# Altium project JOYSTICK.PrjPcb
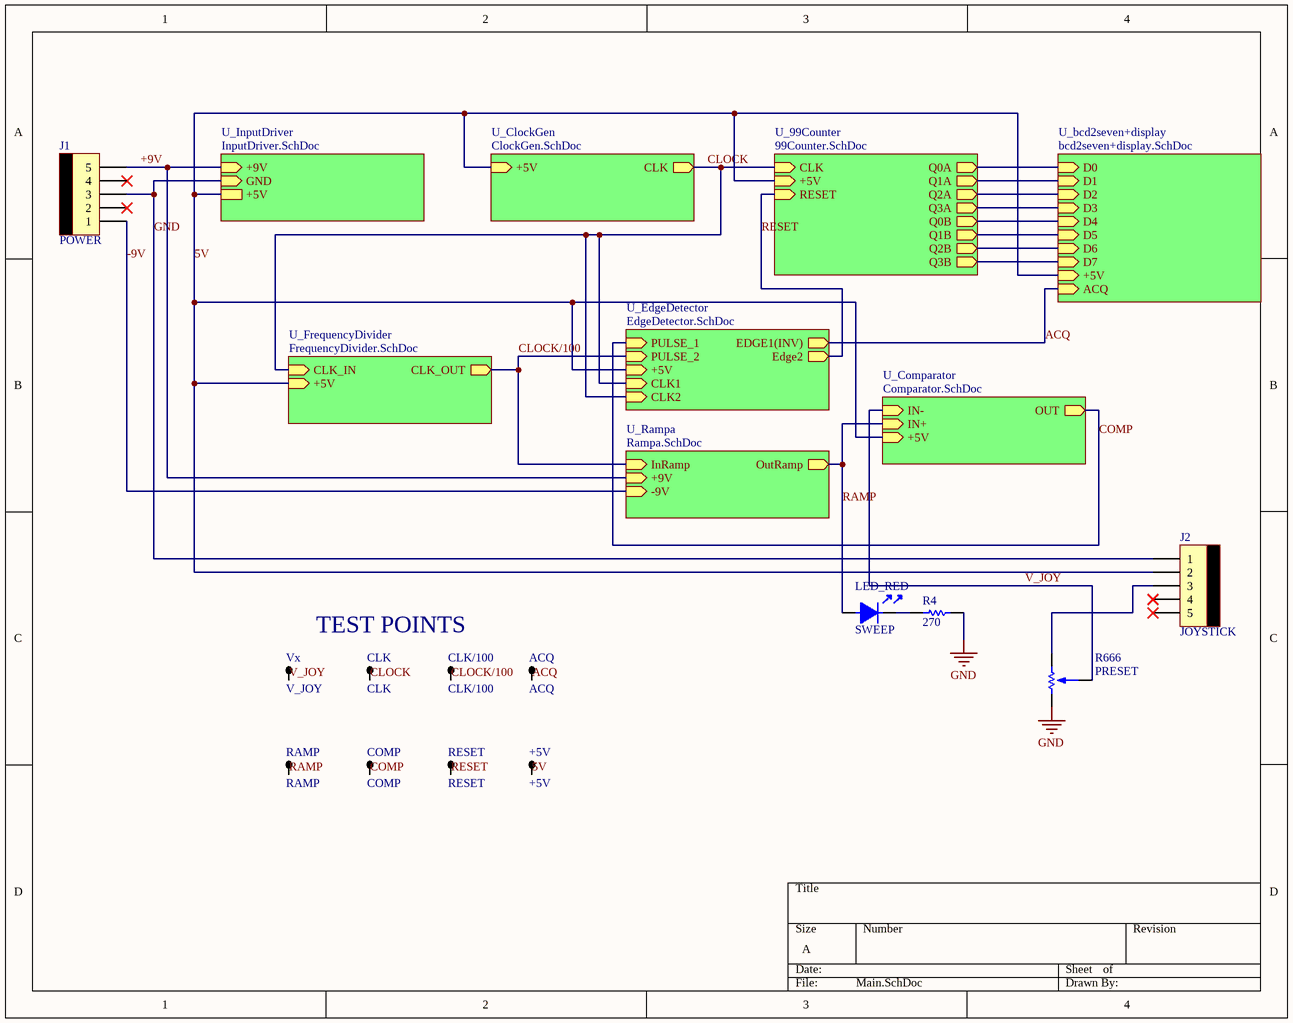
[diagram p0: Main.SchDoc]
9 sheets, 84 parts. Net scope: hierarchical (ports join the sheet entries above them; power ports are global).
Board file: Joystick.PcbDoc
Sheets:
  Main.SchDoc
    U_InputDriver = InputDriver.SchDoc
    U_ClockGen = ClockGen.SchDoc
    U_99Counter = 99Counter.SchDoc
    U_bcd2seven+display = bcd2seven+display.SchDoc
    U_FrequencyDivider = FrequencyDivider.SchDoc
    U_EdgeDetector = EdgeDetector.SchDoc
    U_Rampa = Rampa.SchDoc
    U_Comparator = Comparator.SchDoc

## Sheet Main.SchDoc
size A

### Parts
+5V  +5V  [TPTH]
ACQ  ACQ  [TPTH]
CLK  CLK  [TPTH]
CLK/100  CLK/100  [TPTH]
COMP  COMP  [TPTH]
J1  POWER  [MOLEX5]
J2  JOYSTICK  [MOLEX5]
LED_RED  SWEEP  [LED3]
R4  270  [0805]
R666  PRESET  [PRESET V]
RAMP  RAMP  [TPTH]
RESET  RESET  [TPTH]
Vx  V_JOY  [TPTH]

### Sub-sheets
U_99Counter = 99Counter.SchDoc: CLK (in), +5V (in), RESET (in), Q0A (out), Q1A (out), Q2A (out), Q3A (out), Q0B (out), Q1B (out), Q2B (out), Q3B (out)
U_bcd2seven+display = bcd2seven+display.SchDoc: D0 (in), D1 (in), D2 (in), D3 (in), D4 (in), D5 (in), D6 (in), D7 (in), +5V (in), ACQ (in)
U_ClockGen = ClockGen.SchDoc: +5V (in), CLK (out)
U_Comparator = Comparator.SchDoc: IN- (in), IN+ (in), OUT (out), +5V (in)
U_EdgeDetector = EdgeDetector.SchDoc: Edge2 (out), +5V (in), EDGE1(INV) (out), PULSE_1 (in), PULSE_2 (in), CLK1 (in), CLK2 (in)
U_FrequencyDivider = FrequencyDivider.SchDoc: CLK_IN (in), +5V (in), CLK_OUT (out)
U_InputDriver = InputDriver.SchDoc: +9V (in), GND (in), +5V
U_Rampa = Rampa.SchDoc: InRamp (in), OutRamp (out), +9V (in), -9V (in)

### Nets
GND: J1.3 J2.1 R4.2 R666.3 ; sheet U_InputDriver/GND
5V: +5V.1 J2.2 ; sheet U_InputDriver/+5V, sheet U_ClockGen/+5V, sheet U_99Counter/+5V, sheet U_bcd2seven+display/+5V, sheet U_FrequencyDivider/+5V, sheet U_EdgeDetector/+5V, sheet U_Comparator/+5V
+9V: J1.5 ; sheet U_InputDriver/+9V, sheet U_Rampa/+9V
-9V: J1.1 ; sheet U_Rampa/-9V
ACQ: ACQ.1 ; sheet U_bcd2seven+display/ACQ, sheet U_EdgeDetector/EDGE1(INV)
CLOCK: CLK.1 ; sheet U_ClockGen/CLK, sheet U_99Counter/CLK, sheet U_FrequencyDivider/CLK_IN, sheet U_EdgeDetector/CLK1, sheet U_EdgeDetector/CLK2
CLOCK/100: CLK/100.1 ; sheet U_FrequencyDivider/CLK_OUT, sheet U_EdgeDetector/PULSE_2, sheet U_Rampa/InRamp
COMP: COMP.1 ; sheet U_EdgeDetector/PULSE_1, sheet U_Comparator/OUT
RAMP: LED_RED.1 RAMP.1 ; sheet U_Rampa/OutRamp, sheet U_Comparator/IN+
RESET: RESET.1 ; sheet U_99Counter/RESET, sheet U_EdgeDetector/Edge2
V_JOY: R666.2 Vx.1 ; sheet U_Comparator/IN-
NetDEC1_1: sheet U_99Counter/Q1A, sheet U_bcd2seven+display/D1
NetDEC1_2: sheet U_99Counter/Q2A, sheet U_bcd2seven+display/D2
NetDEC1_6: sheet U_99Counter/Q3A, sheet U_bcd2seven+display/D3
NetDEC1_7: sheet U_99Counter/Q0A, sheet U_bcd2seven+display/D0
NetDEC2_1: sheet U_99Counter/Q1B, sheet U_bcd2seven+display/D5
NetDEC2_2: sheet U_99Counter/Q2B, sheet U_bcd2seven+display/D6
NetDEC2_6: sheet U_99Counter/Q3B, sheet U_bcd2seven+display/D7
NetDEC2_7: sheet U_99Counter/Q0B, sheet U_bcd2seven+display/D4
NetJ2_3: J2.3 R666.1
NetLED_RED_2: LED_RED.2 R4.1

Not connected (* = marked no-connect by the designer): J1 2* 4*; J2 4* 5*

### Notes on the sheet
- TEST POINTS

### Library data of the parts
+5V ACQ CLK CLK/100 COMP RAMP RESET Vx = TP
J1 J2 = MOLEX5
LED_RED = LED
R4 = RES

## Sheet InputDriver.SchDoc
size A
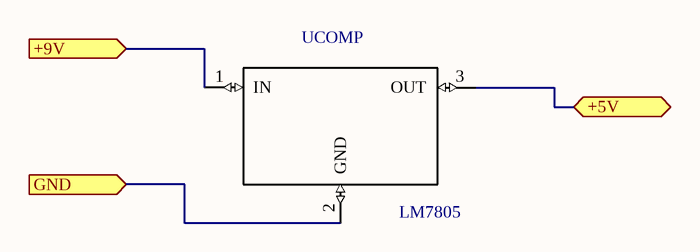
[diagram p1: InputDriver.SchDoc]

### Parts
UCOMP  LM7805  [TO-220 V]

### Ports
+5V, +9V (in), GND (in)

### Nets
GND: UCOMP.2(GND) ; port GND
5V: UCOMP.3(OUT) ; port +5V
+9V: UCOMP.1(IN) ; port +9V

### Library data of the parts
UCOMP = LM7805: MF: Texas Instruments; Package: TO-220 Texas Instruments; Availability: Unavailable; MP: LM7805; SnapEDA_Link: https://www.snapeda.com/parts/LM7805/Texas%20Instruments/view-part/?ref=snap; Price: None; Value: *

## Sheet ClockGen.SchDoc
size A
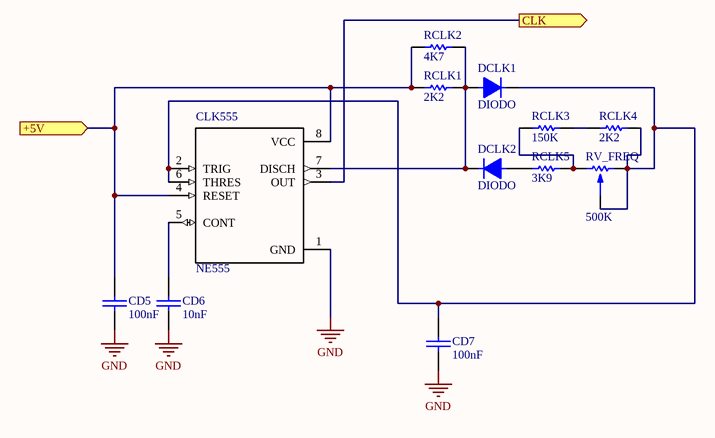
[diagram p2: ClockGen.SchDoc]

### Parts
CD5  100nF  [0805]
CD6  10nF  [0805]
CD7  100nF  [0805]
CLK555  NE555  [*DIP794W45P254L1060H508Q8]
DCLK1  DIODO  [DO41]
DCLK2  DIODO  [DO41]
RCLK1  2K2  [0805]
RCLK2  4K7  [0805]
RCLK3  150K  [0805]
RCLK4  2K2  [0805]
RCLK5  3K9  [0805]
RV_FREQ  500K  [PRESET V]

### Ports
+5V (in), CLK (out)

### Nets
GND: CD5.2 CD6.2 CD7.2 CLK555.1(GND)
5V: CD5.1 CLK555.4(RESET) CLK555.8(VCC) RCLK1.2 RCLK2.1 ; port +5V
CLOCK: CLK555.3(OUT) ; port CLK
NetCD6_1: CD6.1 CLK555.5(CONT)
NetCD7_1: CD7.1 CLK555.2(TRIG) CLK555.6(THRES) DCLK1.2 RCLK4.2 RV_FREQ.1 RV_FREQ.2
NetCLK555_7: CLK555.7(DISCH) DCLK1.1 DCLK2.2 RCLK1.1 RCLK2.2
NetDCLK2_1: DCLK2.1 RCLK5.1
NetRCLK3_1: RCLK3.1 RCLK5.2 RV_FREQ.3
NetRCLK3_2: RCLK3.2 RCLK4.1

### Library data of the parts
CD5-CD7 = CAP
CLK555 = NE555: MF: Texas Instruments; Availability: Unavailable; Package: SOIC-8 Conrad; SnapEDA_Link: https://www.snapeda.com/parts/NE555/Texas%20Instruments/view-part/?ref=snap; Price: None; MP: NE555; Value: *
RCLK1-RCLK5 = RES
RV_FREQ = PRESET

## Sheet 99Counter.SchDoc
size A
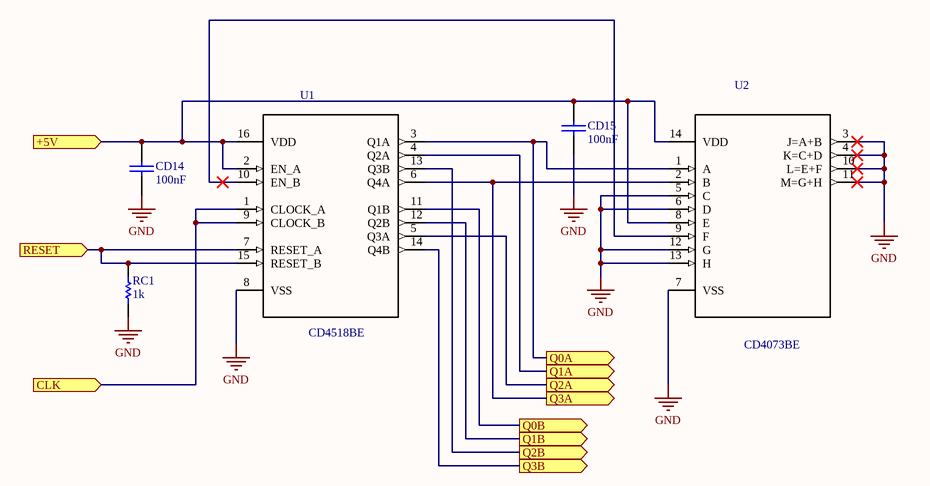
[diagram p3: 99Counter.SchDoc]

### Parts
CD14  100nF  [0805]
CD15  100nF  [0805]
RC1  1k  [0805]
U1  CD4518BE  [*DIP254P762X508-16]
U2  CD4073BE  [*DIP254P762X508-14]

### Ports
+5V (in), CLK (in), Q0A (out), Q0B (out), Q1A (out), Q1B (out), Q2A (out), Q2B (out), Q3A (out), Q3B (out), RESET (in)

### Nets
GND: CD14.2 CD15.2 RC1.1 U1.8(VSS) U2.3(J=A+B) U2.4(K=C+D) U2.5(C) U2.6(D) U2.7(VSS) U2.10(L=E+F) U2.11(M=G+H) U2.12(G) U2.13(H)
5V: CD14.1 CD15.1 U1.2(EN_A) U1.16(VDD) U2.8(E) U2.14(VDD) ; port +5V
CLOCK: U1.1(CLOCK_A) U1.9(CLOCK_B) ; port CLK
RESET: RC1.2 U1.7(RESET_A) U1.15(RESET_B) ; port RESET
NetDEC1_1: U1.4(Q2A) ; port Q1A
NetDEC1_2: U1.5(Q3A) ; port Q2A
NetDEC1_6: U1.6(Q4A) U2.2(B) ; port Q3A
NetDEC1_7: U1.3(Q1A) U2.1(A) ; port Q0A
NetDEC2_1: U1.12(Q2B) ; port Q1B
NetDEC2_2: U1.13(Q3B) ; port Q2B
NetDEC2_6: U1.14(Q4B) ; port Q3B
NetDEC2_7: U1.11(Q1B) ; port Q0B
NetU1_10: U1.10(EN_B) U2.9(F)

### Library data of the parts
CD14 CD15 = CAP
RC1 = RES
U1 = CD4518BE: MF: Texas Instruments; MP: CD4518BE; SnapEDA_Link: https://www.snapeda.com/parts/CD4518BE/Texas%20Instruments/view-part/?ref=snap; Price: None; Package: DIP-16 RCA; Availability: Unavailable; Value: *
U2 = CD4073BE: IC: digital; AND; Channels: 3; Inputs: 3; CMOS; THT; DIP1; MF: Texas Instruments; Package: DIP-14 Texas Instruments; Availability: Unavailable; MP: CD4073BE; SnapEDA_Link: https://www.snapeda.com/parts/CD4073BE/Texas%20Instruments/view-part/?ref=snap; Price: None; Value: *

## Sheet bcd2seven+display.SchDoc
size A
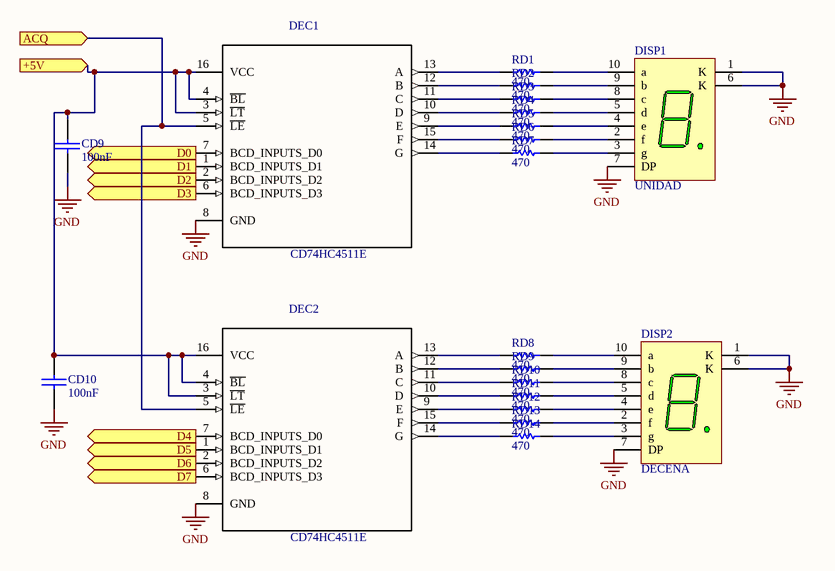
[diagram p4: bcd2seven+display.SchDoc]

### Parts
CD9  100nF  [0805]
CD10  100nF  [0805]
DEC1  CD74HC4511E  [*DIP254P762X508-16]
DEC2  CD74HC4511E  [*DIP254P762X508-16]
DISP1  UNIDAD  [DISPLAY_LED_0.3"]
DISP2  DECENA  [DISPLAY_LED_0.3"]
RD1  470  [0805]
RD2  470  [0805]
RD3  470  [0805]
RD4  470  [0805]
RD5  470  [0805]
RD6  470  [0805]
RD7  470  [0805]
RD8  470  [0805]
RD9  470  [0805]
RD10  470  [0805]
RD11  470  [0805]
RD12  470  [0805]
RD13  470  [0805]
RD14  470  [0805]

### Ports
+5V (in), ACQ (in), D0 (in), D1 (in), D2 (in), D3 (in), D4 (in), D5 (in), D6 (in), D7 (in)

### Nets
GND: CD9.2 CD10.2 DEC1.8(GND) DEC2.8(GND) DISP1.1(K) DISP1.6(K) DISP1.7(DP) DISP2.1(K) DISP2.6(K) DISP2.7(DP)
5V: CD9.1 CD10.1 DEC1.3(~{LT}) DEC1.4(~{BL}) DEC1.16(VCC) DEC2.3(~{LT}) DEC2.4(~{BL}) DEC2.16(VCC) ; port +5V
ACQ: DEC1.5(~{LE}) DEC2.5(~{LE}) ; port ACQ
NetDEC1_1: DEC1.1(BCD_INPUTS_D1) ; port D1
NetDEC1_2: DEC1.2(BCD_INPUTS_D2) ; port D2
NetDEC1_6: DEC1.6(BCD_INPUTS_D3) ; port D3
NetDEC1_7: DEC1.7(BCD_INPUTS_D0) ; port D0
NetDEC1_9: DEC1.9(E) RD5.1
NetDEC1_10: DEC1.10(D) RD4.1
NetDEC1_11: DEC1.11(C) RD3.1
NetDEC1_12: DEC1.12(B) RD2.1
NetDEC1_13: DEC1.13(A) RD1.1
NetDEC1_14: DEC1.14(G) RD7.1
NetDEC1_15: DEC1.15(F) RD6.1
NetDEC2_1: DEC2.1(BCD_INPUTS_D1) ; port D5
NetDEC2_2: DEC2.2(BCD_INPUTS_D2) ; port D6
NetDEC2_6: DEC2.6(BCD_INPUTS_D3) ; port D7
NetDEC2_7: DEC2.7(BCD_INPUTS_D0) ; port D4
NetDEC2_9: DEC2.9(E) RD12.1
NetDEC2_10: DEC2.10(D) RD11.1
NetDEC2_11: DEC2.11(C) RD10.1
NetDEC2_12: DEC2.12(B) RD9.1
NetDEC2_13: DEC2.13(A) RD8.1
NetDEC2_14: DEC2.14(G) RD14.1
NetDEC2_15: DEC2.15(F) RD13.1
NetDISP1_2: DISP1.2(f) RD6.2
NetDISP1_3: DISP1.3(g) RD7.2
NetDISP1_4: DISP1.4(e) RD5.2
NetDISP1_5: DISP1.5(d) RD4.2
NetDISP1_8: DISP1.8(c) RD3.2
NetDISP1_9: DISP1.9(b) RD2.2
NetDISP1_10: DISP1.10(a) RD1.2
NetDISP2_2: DISP2.2(f) RD13.2
NetDISP2_3: DISP2.3(g) RD14.2
NetDISP2_4: DISP2.4(e) RD12.2
NetDISP2_5: DISP2.5(d) RD11.2
NetDISP2_8: DISP2.8(c) RD10.2
NetDISP2_9: DISP2.9(b) RD9.2
NetDISP2_10: DISP2.10(a) RD8.2

### Library data of the parts
CD9 CD10 = CAP
DEC1 DEC2 = CD74HC4511E: High Speed CMOS Logic BCD-to-7 Segment Latch/Decoder/Driver 16-PDIP -55 to 125; MF: Texas Instruments; Package: PDIP-16 Texas Instruments; MP: CD74HC4511E; Digi-Key_Purchase_URL: https://www.digikey.com/product-detail/en/texas-instruments/CD74HC4511E/296-14537-5-ND/555825?utm_source=snapeda&utm_medium=aggregator&utm_campaign=symbol; Digi-Key_Part_Number: 296-14537-5-ND; SnapEDA_Link: https://www.snapeda.com/parts/CD74HC4511E/Texas%20Instruments/view-part/?ref=snap; Value: *
DISP1 DISP2 = DISPLAY 7SEG K: Display 7 Segmentos Catodo Común
RD1-RD14 = RES

## Sheet FrequencyDivider.SchDoc
size A
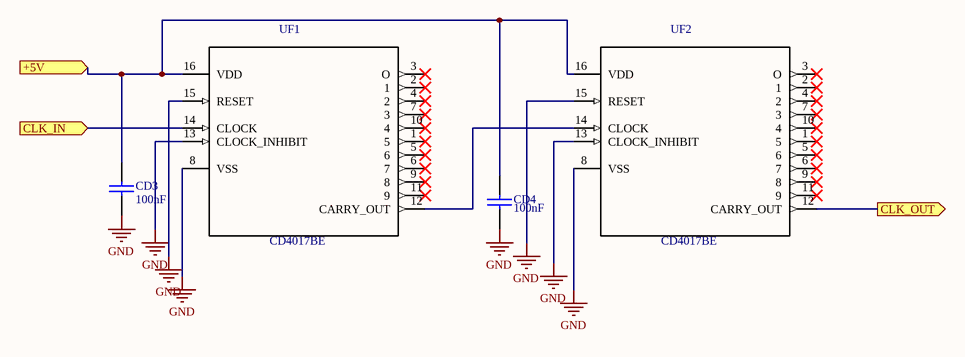
[diagram p5: FrequencyDivider.SchDoc]

### Parts
CD3  100nF  [0805]
CD4  100nF  [0805]
UF1  CD4017BE  [*DIP254P762X508-16]
UF2  CD4017BE  [*DIP254P762X508-16]

### Ports
+5V (in), CLK_IN (in), CLK_OUT (out)

### Nets
GND: CD3.1 CD4.1 UF1.8(VSS) UF1.13(CLOCK_INHIBIT) UF1.15(RESET) UF2.8(VSS) UF2.13(CLOCK_INHIBIT) UF2.15(RESET)
5V: CD3.2 CD4.2 UF1.16(VDD) UF2.16(VDD) ; port +5V
CLOCK: UF1.14(CLOCK) ; port CLK_IN
CLOCK/100: UF2.12(CARRY_OUT) ; port CLK_OUT
NetUF1_12: UF1.12(CARRY_OUT) UF2.14(CLOCK)

Not connected (* = marked no-connect by the designer): UF1 1(5)* 2(1)* 3(O)* 4(2)* 5(6)* 6(7)* 7(3)* 9(8)* 10(4)* 11(9)*; UF2 1(5)* 2(1)* 3(O)* 4(2)* 5(6)* 6(7)* 7(3)* 9(8)* 10(4)* 11(9)*

### Library data of the parts
CD3 CD4 = CAP
UF1 UF2 = CD4017BE: IC Mos 4017/CD4017BE HARRIS; MF: Texas; Price: None; Package: DIP-16 Intersil; SnapEDA_Link: https://www.snapeda.com/parts/CD4017BE/Texas%20Instruments/view-part/?ref=snap; Availability: Unavailable; MP: CD4017BE; Value: *

## Sheet EdgeDetector.SchDoc
size A
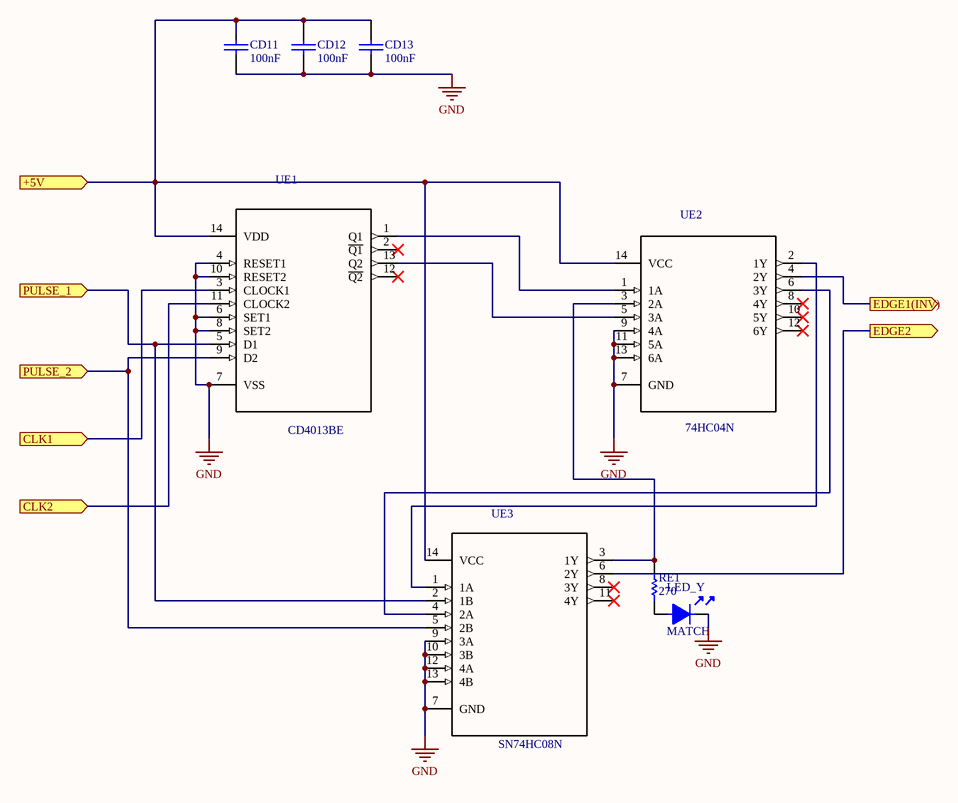
[diagram p6: EdgeDetector.SchDoc]

### Parts
CD11  100nF  [0805]
CD12  100nF  [0805]
CD13  100nF  [0805]
LED_Y  MATCH  [LED3]
RE1  270  [0805]
UE1  CD4013BE  [*DIP254P762X508-14]
UE2  74HC04N  [*DIP254P762X420-14]
UE3  SN74HC08N  [*DIP254P762X508-14]

### Ports
+5V (in), CLK1 (in), CLK2 (in), EDGE1(INV) (out), EDGE2 (out), PULSE_1 (in), PULSE_2 (in)

### Nets
GND: CD11.2 CD12.2 CD13.2 LED_Y.2 UE1.4(RESET1) UE1.6(SET1) UE1.7(VSS) UE1.8(SET2) UE1.10(RESET2) UE2.7(GND) UE2.9(4A) UE2.11(5A) UE2.13(6A) UE3.7(GND) UE3.9(3A) UE3.10(3B) UE3.12(4A) UE3.13(4B)
5V: CD11.1 CD12.1 CD13.1 UE1.14(VDD) UE2.14(VCC) UE3.14(VCC) ; port +5V
ACQ: UE2.4(2Y) ; port EDGE1(INV)
CLOCK: UE1.3(CLOCK1) UE1.11(CLOCK2) ; port CLK1, port CLK2
CLOCK/100: UE1.9(D2) UE3.5(2B) ; port PULSE_2
COMP: UE1.5(D1) UE3.2(1B) ; port PULSE_1
RESET: UE3.6(2Y) ; port EDGE2
NetLED_Y_1: LED_Y.1 RE1.1
NetRE1_2: RE1.2 UE2.3(2A) UE3.3(1Y)
NetUE1_1: UE1.1(Q1) UE2.1(1A)
NetUE1_13: UE1.13(Q2) UE2.5(3A)
NetUE2_2: UE2.2(1Y) UE3.1(1A)
NetUE2_6: UE2.6(3Y) UE3.4(2A)

Not connected (* = marked no-connect by the designer): UE1 2(~{Q1})* 12(~{Q2})*; UE2 8(4Y)* 10(5Y)* 12(6Y)*; UE3 8(3Y)* 11(4Y)*

### Library data of the parts
CD11-CD13 = CAP
LED_Y = LED
RE1 = RES
UE1 = CD4013BE: Flip Flop D-Type Pos-Edge 2-Element 14-Pin PDIP; MF: Texas; Package: DIP-14 RCA; Availability: Unavailable; MP: CD4013BE; SnapEDA_Link: https://www.snapeda.com/parts/CD4013BE/Texas%20Instruments/view-part/?ref=snap; Price: None; Value: *
UE2 = 74HC04N: Inverter 6-Element CMOS 14-Pin PDIP Inverter 6-Element CMOS 14-Pin PDIP; MF: Texas Instruments; Price: None; SnapEDA_Link: https://www.snapeda.com/parts/74HC04N/Texas%20Instruments/view-part/?ref=snap; MP: 74HC04N; Package: DIP-14 NXP Semiconductors; Availability: Unavailable; Value: *
UE3 = SN74HC08N: AND Gate 4-Element 2-IN CMOS 14-Pin PDIP Tube; MF: Texas Instruments; SnapEDA_Link: https://www.snapeda.com/parts/SN74HC08N/Texas%20Instruments/view-part/?ref=snap; Price: None; MP: SN74HC08N; Availability: Unavailable; Package: PDIP-14 Signetics; Value: *

## Sheet Rampa.SchDoc
size A
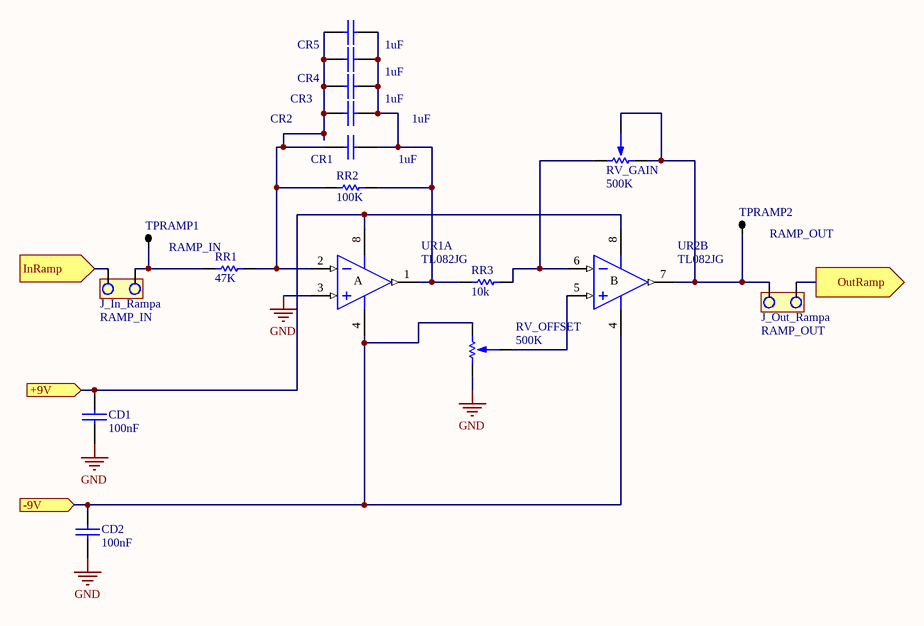
[diagram p7: Rampa.SchDoc]

### Parts
CD1  100nF  [0805]
CD2  100nF  [0805]
CR1  1uF  [0805]
CR2  1uF  [0805]
CR3  1uF  [0805]
CR4  1uF  [0805]
CR5  1uF  [0805]
J_In_Rampa  RAMP_IN  [JUMPER2]
J_Out_Rampa  RAMP_OUT  [JUMPER2]
RR1  47K  [0805]
RR2  100K  [0805]
RR3  10k  [0805]
RV_GAIN  500K  [PRESET V]
RV_OFFSET  500K  [PRESET V]
TPRAMP1  RAMP_IN  [TPTH]
TPRAMP2  RAMP_OUT  [TPTH]
UR1  TL082JG  [JG008]  (part A of 2)
UR2  TL082JG  [JG008]  (part B of 2)

### Ports
+9V (in), -9V (in), InRamp (in), OutRamp (out)

### Nets
GND: CD1.2 CD2.2 RV_OFFSET.3 UR1.3(IN+)
+9V: CD1.1 UR1.8(V+) UR2.8(V+) ; port +9V
-9V: CD2.1 RV_OFFSET.1 UR1.4(V-) UR2.4(V-) ; port -9V
CLOCK/100: J_In_Rampa.1 ; port InRamp
RAMP: J_Out_Rampa.2 ; port OutRamp
NetCR1_1: CR1.1 CR2.1 CR3.1 CR4.1 CR5.1 RR1.2 RR2.1 UR1.2(IN-)
NetCR1_2: CR1.2 CR2.2 CR3.2 CR4.2 CR5.2 RR2.2 RR3.1 UR1.1(OUT)
NetJ_In_Rampa_2: J_In_Rampa.2 RR1.1 TPRAMP1.1
NetJ_Out_Rampa_1: J_Out_Rampa.1 RV_GAIN.2 RV_GAIN.3 TPRAMP2.1 UR2.7(OUT)
NetRR3_2: RR3.2 RV_GAIN.1 UR2.6(IN-)
NetRV_OFFSET_2: RV_OFFSET.2 UR2.5(IN+)

### Notes on the sheet
- (in symbol TL082JG, part A) A
- (in symbol TL082JG, part B) B

### Library data of the parts
CD1 CD2 CR1-CR5 = CAP
J_In_Rampa J_Out_Rampa = JUMPER
RR1-RR3 = RES
RV_GAIN RV_OFFSET = PRESET
TPRAMP1 TPRAMP2 = TP
UR1 UR2 = TL082JG: JFET-Input Operational Amplifier; Published: 16-Jan-2001; LatestRevisionDate: 04-Mar-2005; LatestRevisionNote: Stylized 3D Model Added.; DatasheetVersion: Feb-1999; PackageVersion: Jan-1995; PackageReference: JG008; Publisher: Altium Limited; PackageDescription: DIP; 8 Leads; Row Spacing 7.62 mm; Pitch 2.54 mm; ComponentLink1Description: Manufacturer Link; ComponentLink1URL: http://www.ti.com/; ComponentLink2Description: Datasheet; ComponentLink2URL: http://www-s.ti.com/sc/ds/tl082.pdf

## Sheet Comparator.SchDoc
size A
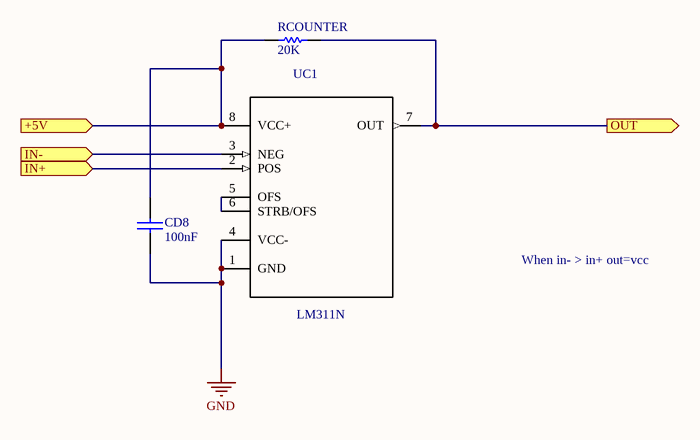
[diagram p8: Comparator.SchDoc]

### Parts
CD8  100nF  [0805]
RCOUNTER  20K  [0805]
UC1  LM311N  [*DIP254P762X480-8]

### Ports
+5V (in), IN+ (in), IN- (in), OUT (out)

### Nets
GND: CD8.2 UC1.1(GND) UC1.4(VCC-)
5V: CD8.1 RCOUNTER.1 UC1.8(VCC+) ; port +5V
COMP: RCOUNTER.2 UC1.7(OUT) ; port OUT
RAMP: UC1.2(POS) ; port IN+
V_JOY: UC1.3(NEG) ; port IN-
NetUC1_5: UC1.5(OFS) UC1.6(STRB/OFS)

### Notes on the sheet
- When in- > in+ out=vcc

### Library data of the parts
CD8 = CAP
RCOUNTER = RES
UC1 = LM311N: IC VOLTAGE COMPARATOR 8-DIP; MF: Texas Instruments; Package: DIP-8 AMD; Availability: Unavailable; MP: LM311N; SnapEDA_Link: https://www.snapeda.com/parts/LM311N/Texas%20Instruments/view-part/?ref=snap; Price: None; Value: *

## Nets that join several sheets
GND: Main (J1.3 J2.1 R4.2 R666.3), InputDriver (UCOMP.2), ClockGen (CD5.2 CD6.2 CD7.2 CLK555.1), 99Counter (13 pins), bcd2seven+display (10 pins), FrequencyDivider (8 pins), EdgeDetector (18 pins), Rampa (CD1.2 CD2.2 RV_OFFSET.3 UR1.3), Comparator (CD8.2 UC1.1 UC1.4)
5V: Main (+5V.1 J2.2), InputDriver (UCOMP.3), ClockGen (5 pins), 99Counter (6 pins), bcd2seven+display (8 pins), FrequencyDivider (CD3.2 CD4.2 UF1.16 UF2.16), EdgeDetector (6 pins), Comparator (CD8.1 RCOUNTER.1 UC1.8)
+9V: Main (J1.5), InputDriver (UCOMP.1), Rampa (CD1.1 UR1.8 UR2.8)
-9V: Main (J1.1), Rampa (CD2.1 RV_OFFSET.1 UR1.4 UR2.4)
ACQ: Main (ACQ.1), bcd2seven+display (DEC1.5 DEC2.5), EdgeDetector (UE2.4)
CLOCK: Main (CLK.1), ClockGen (CLK555.3), 99Counter (U1.1 U1.9), FrequencyDivider (UF1.14), EdgeDetector (UE1.3 UE1.11)
CLOCK/100: Main (CLK/100.1), FrequencyDivider (UF2.12), EdgeDetector (UE1.9 UE3.5), Rampa (J_In_Rampa.1)
COMP: Main (COMP.1), EdgeDetector (UE1.5 UE3.2), Comparator (RCOUNTER.2 UC1.7)
NetDEC1_1: 99Counter (U1.4), bcd2seven+display (DEC1.1)
NetDEC1_2: 99Counter (U1.5), bcd2seven+display (DEC1.2)
NetDEC1_6: 99Counter (U1.6 U2.2), bcd2seven+display (DEC1.6)
NetDEC1_7: 99Counter (U1.3 U2.1), bcd2seven+display (DEC1.7)
NetDEC2_1: 99Counter (U1.12), bcd2seven+display (DEC2.1)
NetDEC2_2: 99Counter (U1.13), bcd2seven+display (DEC2.2)
NetDEC2_6: 99Counter (U1.14), bcd2seven+display (DEC2.6)
NetDEC2_7: 99Counter (U1.11), bcd2seven+display (DEC2.7)
RAMP: Main (LED_RED.1 RAMP.1), Rampa (J_Out_Rampa.2), Comparator (UC1.2)
RESET: Main (RESET.1), 99Counter (RC1.2 U1.7 U1.15), EdgeDetector (UE3.6)
V_JOY: Main (R666.2 Vx.1), Comparator (UC1.3)